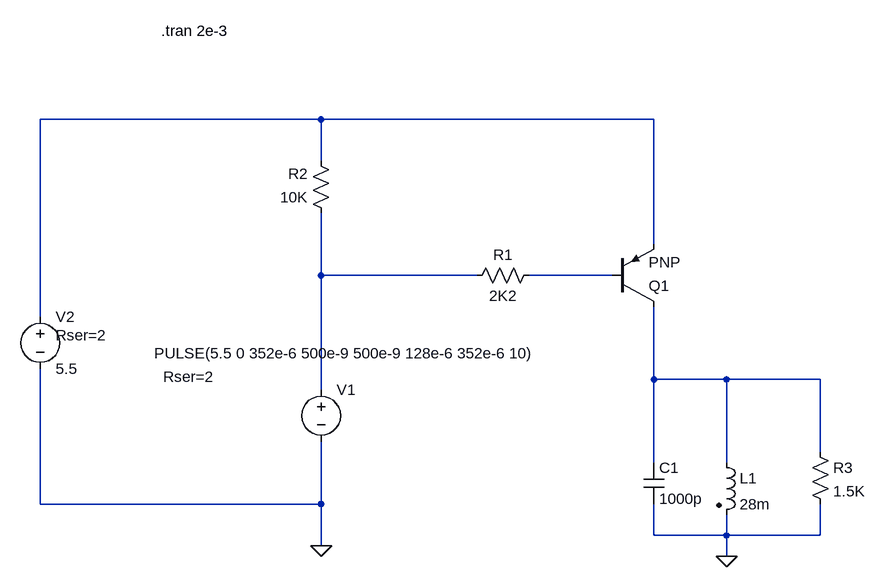
[diagram p0: schematic Buzz_drive_OC.asc]
Buzz_drive_OC.asc, the LTspice schematic file:
Version 4
SHEET 1 880 680
WIRE -528 -448 -960 -448
WIRE -16 -448 -528 -448
WIRE -528 -384 -528 -448
WIRE -16 -256 -16 -448
WIRE -528 -208 -528 -304
WIRE -288 -208 -528 -208
WIRE -80 -208 -208 -208
WIRE -960 -144 -960 -448
WIRE -16 -48 -16 -160
WIRE 96 -48 -16 -48
WIRE 240 -48 96 -48
WIRE -528 -32 -528 -208
WIRE 240 64 240 -48
WIRE -16 80 -16 -48
WIRE 96 80 96 -48
WIRE -960 144 -960 -64
WIRE -528 144 -528 48
WIRE -528 144 -960 144
WIRE -16 192 -16 144
WIRE 96 192 96 160
WIRE 96 192 -16 192
WIRE 240 192 240 144
WIRE 240 192 96 192
WIRE -528 208 -528 144
WIRE 96 224 96 192
FLAG 96 224 0
FLAG -528 208 0
SYMBOL ind2 80 64 R0
SYMATTR InstName L1
SYMATTR Value 28m
SYMATTR Type ind
SYMATTR SpiceLine Rser=2
SYMBOL cap -32 80 R0
SYMATTR InstName C1
SYMATTR Value 1000p
SYMBOL voltage -528 -48 R0
WINDOW 3 -257 -40 Left 2
WINDOW 123 0 0 Left 0
WINDOW 39 -243 -4 Left 2
SYMATTR InstName V1
SYMATTR Value PULSE(5.5 0 352e-6 500e-9 500e-9 128e-6 352e-6 10)
SYMATTR SpiceLine Rser=2
SYMBOL pnp -80 -160 M180
SYMATTR InstName Q1
SYMBOL res -192 -224 R90
WINDOW 0 0 56 VBottom 2
WINDOW 3 32 56 VTop 2
SYMATTR InstName R1
SYMATTR Value 2K2
SYMBOL res -512 -288 R180
WINDOW 0 36 76 Left 2
WINDOW 3 36 40 Left 2
SYMATTR InstName R2
SYMATTR Value 10K
SYMBOL voltage -960 -160 R0
WINDOW 123 0 0 Left 0
WINDOW 39 24 44 Left 2
SYMATTR InstName V2
SYMATTR Value 5.5
SYMATTR SpiceLine Rser=2
SYMBOL res 224 48 R0
SYMATTR InstName R3
SYMATTR Value 1.5K
TEXT -774 -584 Left 2 !.tran 2e-3

The netlist it stands for:
* Buzz_drive_OC.asc
L1 N004 0 28m Rser=2
C1 N004 0 1000p
V1 N002 0 PULSE(5.5 0 352e-6 500e-9 500e-9 128e-6 352e-6 10) Rser=2
Q1 N004 N003 N001 0 PNP
R1 N003 N002 2K2
R2 N002 N001 10K
V2 N001 0 5.5 Rser=2
R3 N004 0 1.5K
.model NPN NPN
.model PNP PNP
.lib standard.bjt
.tran 2e-3
.backanno
.end